# Altium schematic sheet DCDC_Converters.SchDoc: OLC_DCDC_Converters
size A4; ApprovedBy: Emmanuel Plascencia; CheckedBy: Emmanuel Plascencia; DocumentNumber: 2; SheetNumber: 2; SheetTotal: 3; Size: A
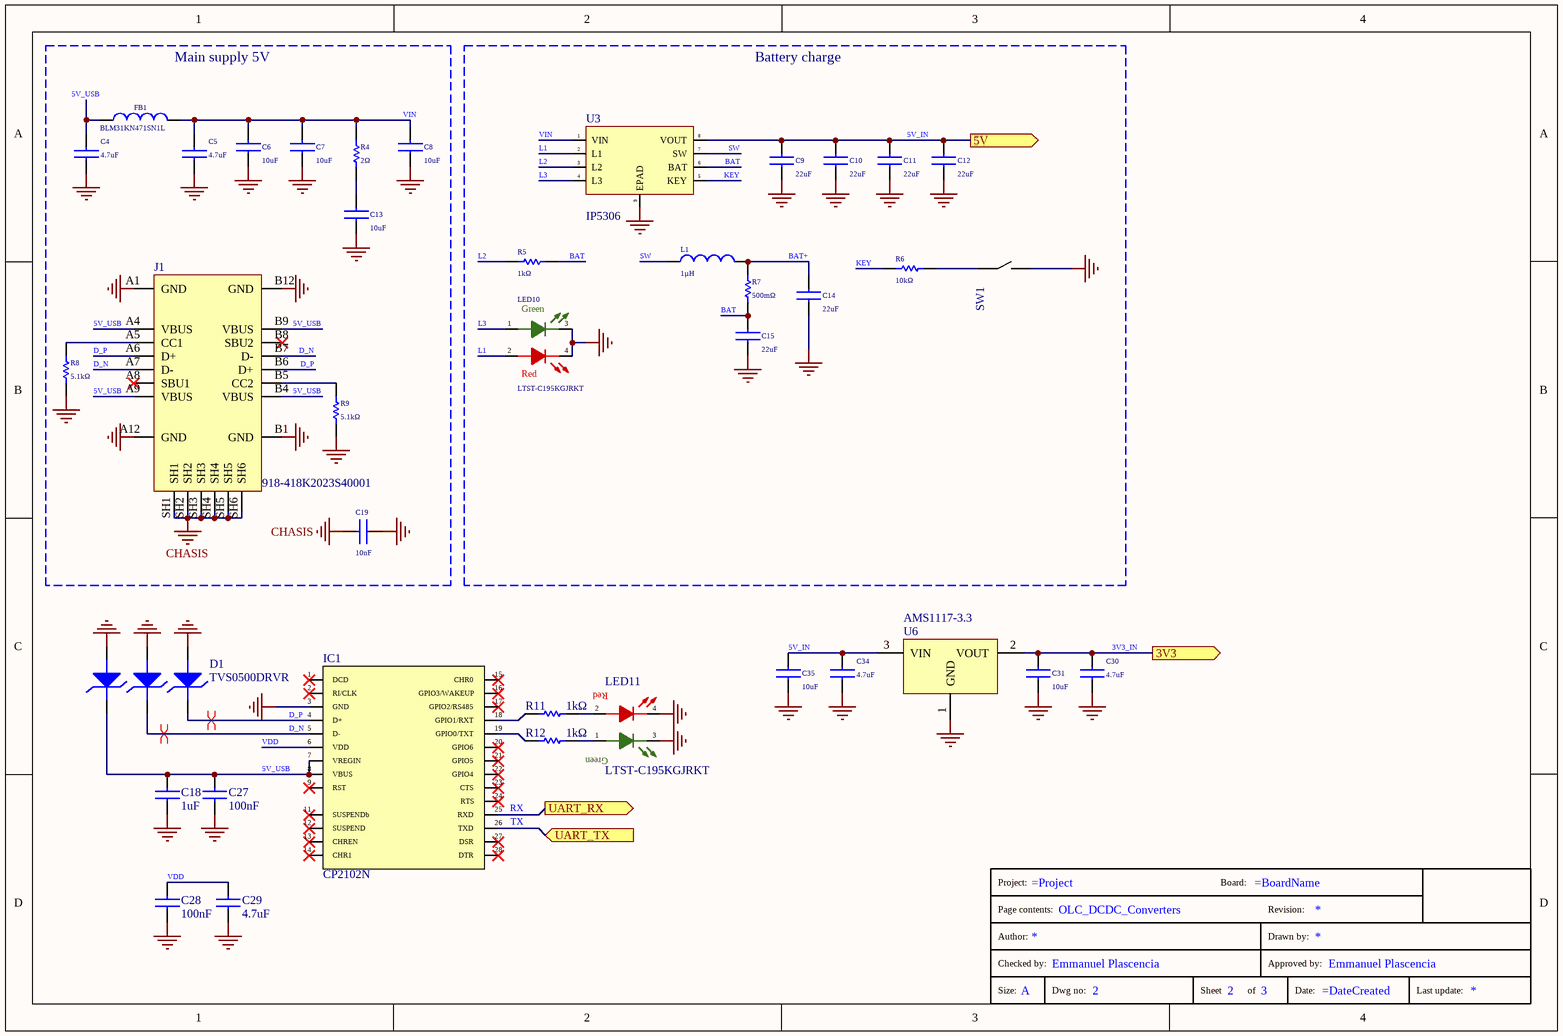
[diagram p0: DCDC_Converters.SchDoc]

## Parts
C4  4.7uF  [CAP0402]
C5  4.7uF  [CAP0402]
C6  10uF  [CAP0402_1.2*0.7]
C7  10uF  [CAP0402_1.2*0.7]
C8  10uF  [CAP0402_1.2*0.7]
C9  22uF  [CAP0805]
C10  22uF  [CAP0805]
C11  22uF  [CAP0805]
C12  22uF  [CAP0805]
C13  10uF  [CAP0402_1.2*0.7]
C14  22uF  [CAP0805]
C15  22uF  [CAP0805]
C18  1uF  [CAP0402]
C19  10nF  [CAP0402]
C27  100nF  [CAP0402]
C28  100nF  [CAP0402]
C29  4.7uF  [CAP0402]
C30  4.7uF  [CAP0402]
C31  10uF  [CAP0402_1.2*0.7]
C34  4.7uF  [CAP0402]
C35  10uF  [CAP0402_1.2*0.7]
D1  TVS0500DRVR  [SON65P200X80_HS-7N]
FB1  BLM31KN471SN1L  [FB1206_3.4*1.8]
IC1  CP2102N  [PQFN50P500X500X80_HS-29N]
J1  918-418K2023S40001  [918-418K2023S40001]
L1  1µH  [IND5030]
LED10  LTST-C195KGJRKT  [LED0606_LTST]
LED11  LTST-C195KGJRKT  [LED0606_LTST]
R4  2Ω  [RES0402]
R5  1kΩ  [RES0201]
R6  10kΩ  [RES0201]
R7  500mΩ  [RES0805]
R8  5.1kΩ  [RES0201]
R9  5.1kΩ  [RES0201]
R11  1kΩ  [RES0402]
R12  1kΩ  [RES0402]
SW1  TS3735PA 300gf 030  [TS3735PA 300gf 030]  (value not drawn)
U3  IP5306  [SOP127P600X165_HS-9N]
U6  AMS1117-3.3  [SOT230P696X180-4N]
U?  Title Block  (value not drawn)  (graphical)

## Blocks framed on the sheet
Main supply 5V: C4-C8 C13 C19 FB1 J1 R4 R8 R9
Battery charge: C9-C12 C14 C15 L1 LED10 R5-R7 SW1 U3

## Ports
3V3 (out), 5V (out), UART_RX (out), UART_TX (in)

## Nets
CHASIS: C19.1 J1.SH1 J1.SH2 J1.SH3 J1.SH4 J1.SH5 J1.SH6
GND: C4.2 C5.2 C6.2 C7.2 C8.2 C9.2 C10.2 C11.2 C12.2 C13.2 C14.2 C15.2 C18.2 C19.2 C27.2 C28.2 C29.2 C30.2 C31.2 C34.2 C35.2 D1.4(A3) D1.5(A2) D1.6(A1) IC1.3(GND) J1.A1(GND) J1.A12(GND) J1.B1(GND) J1.B12(GND) LED10.3 LED10.4 LED11.3 LED11.4 R8.2 R9.2 SW1.2(A2) U3.9(EPAD) U6.1(GND)
3V3_IN: C30.1 C31.1 U6.2(VOUT) ; port 3V3
5V_IN: C9.1 C10.1 C11.1 C12.1 C34.1 C35.1 U3.8(VOUT) U6.3(VIN) ; port 5V
5V_USB: C4.1 C18.1 C27.1 D1.1(K1) FB1.1 IC1.7(VREGIN) IC1.8(VBUS) J1.A4(VBUS) J1.A9(VBUS) J1.B4(VBUS) J1.B9(VBUS)
BAT: C15.1 R5.1 R7.2 U3.6(BAT)
BAT+: C14.1 L1.2 R7.1
D_N: D1.2(K2) IC1.5(D-) J1.A7(D-) J1.B7(D-)
D_P: D1.3(K3) IC1.4(D+) J1.A6(D+) J1.B6(D+)
KEY: R6.1 U3.5(KEY)
L1: LED10.2 U3.2(L1)
L2: R5.2 U3.3(L2)
L3: LED10.1 U3.4(L3)
RX: IC1.25(RXD) ; port UART_RX
SW: L1.1 U3.7(SW)
TX: IC1.26(TXD) ; port UART_TX
VDD: C28.1 C29.1 IC1.6(VDD)
VIN: C5.1 C6.1 C7.1 C8.1 FB1.2 R4.1 U3.1(VIN)
NetC13_1: C13.1 R4.2
NetIC1_18: IC1.18(GPIO1/RXT) R11.1
NetIC1_19: IC1.19(GPIO0/TXT) R12.1
NetJ1_A5: J1.A5(CC1) R8.1
NetJ1_B5: J1.B5(CC2) R9.1
NetLED11_1: LED11.1 R12.2
NetLED11_2: LED11.2 R11.2
NetR6_2: R6.2 SW1.1(A1)

Not connected (* = marked no-connect by the designer): IC1 1(DCD)* 2(RI/CLK)* 9(RST)* 11(SUSPENDb)* 12(SUSPEND)* 13(CHREN)* 14(CHR1)* 15(CHR0)* 16(GPIO3/WAKEUP)* 17(GPIO2/RS485)* 20(GPIO6)* 21(GPIO5)* 22(GPIO4)* 23(CTS)* 24(RTS)* 27(DSR)* 28(DTR)*; J1 A8(SBU1)* B8(SBU2)*

## Layout directives
differential pair; differential pair class Diff_100ohms; net class High_Speed_Nets: D_N, D_P

## Notes on the sheet
- (in symbol LTST-C195KGJRKT) Green; Red
- (in symbol Title Blok OLEDCOMM) Project:; Board:; Page contents:; Revision:; Author:; Drawn by:; Checked by:; Approved by:; Size:; Dwg no:; Sheet; of; Date:; Last update:

## Library data of the parts
C4 C5 C30 C34 = C0402_4.7uF_6V3_X5R: Capacitor ceramic MLCC - SMD 0402 4.7uF, 6V3, X5R, 20%; Ref Fabricant: CL05A475MQ5NRNC; Ref Fournisseur: C307423; Fournisseur: LCSC; Fabricant: Samsung Electro-Mechanics; Unit Price(100): 0.0041; Unit Price(1000): 0.003; Unit Price(5000): 0.0026; Unit Price(1500): 0.0028; Unit Price(25000): 0.0025; Unit Price(50000): 0.0024; Help URL: https://datasheet.lcsc.com/szlcsc/1810231822_Samsung-Electro-Mechanics-CL05A475MQ5NRNC_C307423.pdf; Unit Price: 0.0041; Unit Price(10): 0.0041; Unit Price(50): 0.0041; Unit Price(500): 0.003
C6 C7 C13 = C0402_10uF_6V3_X5R_: Capacitor ceramic MLCC - SMD 0402 10uF, 6V3, X5R, 20%; Fabricant: Samsung Electro-Mechanics; Fournisseur: LCSC; Ref Fournisseur: C15525; Ref Fabricant: CL05A106MQ5NUNC; Unit Price(100): 0.0068; Unit Price(1000): 0.0052; Unit Price(1500): 0.0049; Unit Price(5000): 0.0044; Unit Price(25000): 0.0041; Unit Price(50000): 0.004; Help URL: https://datasheet.lcsc.com/szlcsc/1810191215_Samsung-Electro-Mechanics-CL05A106MQ5NUNC_C15525.pdf; Unit Price: 0.0068; Unit Price(10): 0.0068; Unit Price(50): 0.0068; Unit Price(500): 0.0052
C8 C31 C35 = C0402_10uF_6V3_X5R_: Capacitor ceramic MLCC - SMD 0402 10uF, 6V3, X5R, 20%; Ref Fabricant: CL05A106MQ5NUNC; Ref Fournisseur: C15525; Fournisseur: LCSC; Fabricant: Samsung Electro-Mechanics; Unit Price(100): 0.0068; Unit Price(1000): 0.0052; Unit Price(1500): 0.0049; Unit Price(5000): 0.0044; Unit Price(25000): 0.0041; Unit Price(50000): 0.004; Help URL: https://datasheet.lcsc.com/szlcsc/1810191215_Samsung-Electro-Mechanics-CL05A106MQ5NUNC_C15525.pdf; Unit Price: 0.0068; Unit Price(10): 0.0068; Unit Price(50): 0.0068; Unit Price(500): 0.0052
C9-C12 C14 C15 = C0805_22uF_10V_X7T: Capacitor ceramic MLCC - SMD 0805 22uF, 10V, X7T, 20%; Ref Fabricant: GRM21BD71A226ME44L; Ref Fournisseur: C385042; Fournisseur: LCSC; Fabricant: Murata; Unit Price(100): 0.0840; Unit Price(10): 0.1846; Unit Price(1000): 0.0813; Unit Price(500): 0.0822; Unit Price(30): 0.1627; Help URL: https://datasheet.lcsc.com/lcsc/2001041604_Murata-Electronics-GRM21BD71A226ME44L_C385042.pdf; Unit Price: 0.2147
C18 = C0402_1uF_10V_X7R: Capacitor ceramic MLCC - SMD 0402 1uF, 10V, X7R, 10%; Ref Fabricant: GRM155Z71A105KE01J; Ref Fournisseur: 81-GRM155Z71A105KE1J; Fournisseur: Mouser; Fabricant: Murata; Unit Price(100): 0,034; Unit Price(10): 0,072; Unit Price(1000): 0,02; Unit Price(500): 0,024; Unit Price(5000): 0,017; Unit Price(25000): 0,016; Help URL: https://www.mouser.fr/ProductDetail/Murata-Electronics/GRM155Z71A105KE01J?qs=xZ%2FP%252Ba9zWqaF%2FmyRgV0iOA%3D%3D; Unit Price: 0,102; Unit Price(50): 0,072; Unit Price(1500): 0,02
C19 = C0402_10nF_50V_X7R: Capacitor ceramic MLCC - SMD 0402 10nF, 50V, X7R, 10%; Ref Fabricant: CC0402KRX7R9BB103; Ref Fournisseur: C60133; Fournisseur: LCSC; Fabricant: Yageo; Unit Price(100): 0.001; Unit Price(1000): 0.0008; Unit Price(3000): 0.0007; Unit Price(10000): 0.0006; Unit Price(50000): 0.0005; Help URL: https://datasheet.lcsc.com/lcsc/1810200014_YAGEO-CC0402KRX7R9BB103_C60133.pdf; Unit Price: 0.001; Unit Price(10): 0.001
C27 C28 = C0402_100nF_100V_X5R: Capacitor ceramic MLCC - SMD 0402 100nF, 100V, X5R, 20%; Ref Fabricant: CC0402KRX5R9BB104; Ref Fournisseur: C105882; Fournisseur: LCSC; Fabricant: YAGEO; Unit Price(100): 0.0024; Unit Price(1000): 0.0019; Unit Price(3000): 0.0016; Unit Price(10000): 0.0015; Unit Price(50000): 0.0013; Help URL: https://datasheet.lcsc.com/lcsc/1811131731_YAGEO-CC0402KRX5R9BB104_C105882.pdf; Unit Price: 0.0024; Unit Price(10): 0.0024
C29 = C0402_4.7uF_6V3_X5R: Capacitor ceramic MLCC - SMD 0402 4.7uF, 6V3, X5R, 20%; Ref Fabricant: CL05A475MQ5NRNC; Ref Fournisseur: C307423; Fournisseur: LCSC; Fabricant: Samsung Electro-Mechanics; Unit Price(100): 0.0041; Unit Price(1000): 0.003; Unit Price(1500): 0.0028; Unit Price(5000): 0.0026; Unit Price(25000): 0.0025; Unit Price(50000): 0.0024; Help URL: https://datasheet.lcsc.com/szlcsc/1810231822_Samsung-Electro-Mechanics-CL05A475MQ5NRNC_C307423.pdf; Unit Price: 0.0041; Unit Price(10): 0.0041; Unit Price(50): 0.0041; Unit Price(500): 0.003
D1 = TVS0500DRVR: 27.7VC Clamp 40A@8/20us Ipp TVS DIODE WSON-6-EP(2x2); Fabricant: Texas instruments; Fournisseur: LCSC; Ref Fournisseur: C609571; Unit Price(10): 0.3255; Unit Price(100): 0.2457; Unit Price(1000): 0.2298; Help URL: https://www.ti.com/lit/ds/symlink/tvs0500.pdf?ts=1776012452748; Ref Fabricant: TVS0500DRVR; Unit Price: 0.4117
FB1 = FB1206_470Z_20mR_4A: Ferrite Bead SMD 1206, 470Z, 20mΩ, 4A, 25%; Fabricant: Murata Electronics; Fournisseur: LCSC; Ref Fournisseur: C703117; Unit Price(100): 0.083; Unit Price(10): 0.0962; Unit Price(1000): 0.0786; Unit Price(30): 0.0896; Unit Price(500): 0.08; Help URL: https://www.mouser.fr/datasheet/2/281/c31e-794748.pdf; Ref Fabricant: BLM31KN471SN1L; Unit Price: 0.1323
IC1 = CP2102N: USB to UART USB 2.0 QFN-28-EP(5x5) Interface Controllers RoHS; Fournisseur: LCSC; Ref Fournisseur: C964632; Fabricant: Silicon Labs; Ref Fabricant: CP2102N-A02-GQFN28R; Unit Price(10): 1.3771; Unit Price(100): 1.1014; Help URL: https://www.lcsc.com/datasheet/C964632.pdf?spm=wm.sxq.inf.ggs___wm.fly.bg.1.xh&lcsc_vid=FgJXV1VSRgJaVwUHEgQNVVQEQlFXBl0FFVhdUwYFRgUxVlNRQVFWUVdQQllYUjsOAxUeFF5JWBYZEEoKFBINSQcJGk4dAgUUFAk%3D; Unit Price: 1.58
J1 = 918-418K2023S40001: USB 2.0 F type C, SMD; Fournisseur: LCSC; Ref Fournisseur: C167321; Fabricant: Jing Extension of the Electronic Co.; Unit Price(100): 0.2512; Unit Price(10): 0.2788; Unit Price(1000): 0.242; Unit Price(30): 0.265; Unit Price(500): 0.2451; Help URL: http://www.dzyjzj.com/Uploads/Product/USB%20TYPE%20C%203.1%20%E5%9B%9B%E8%84%9A%E6%8F%92%E6%9D%BF%20%E5%8F%8C%E6%8E%92SMT%20%E6%9C%89%E6%9F%B1%E6%97%A0%E5%87%B8%E5%8C%85/USB%20TYPE%20C%203.1%20%E5%9B%9B%E8%84%9A%E6%8F%92%E6%9D%BF%20%E5%8F%8C%E6%8E%92SMT%20%E6%9C%89%E6%9F%B1%E6%97%A0%E5%87%B8%E5%8C%85%E5%B7%A5%E7%A8%8B%E5%9B%BE.jpg; Ref Fabricant: 918-418K2023S40001; Unit Price: 0.3539
L1 = IND5030_1µH_10.5mR_8.5A: 8.5A 1uH ±20% 8.5A 10.5mΩ SMD,5.2x5.7mm Inductors (SMD) ROHS; Fabricant: KOHERelec; Fournisseur: LCSC; Ref Fabricant: MDA5030-1R0M; Ref Fournisseur: C2847474; Unit Price(100): 0.3677; Unit Price(10): 0.4595; Unit Price(1000): 0.2924; Help URL: https://datasheet.lcsc.com/lcsc/2109101630_KOHERelec-MDA5030-1R0M_C2847474.pdf; Unit Price: 0.5514
LED10 LED11 = LTST-C195KGJRKT: LED standard - CMS Green/Red Clear 571nm/631nm, 0606; Ref Fournisseur: C125104; Fournisseur: LCSC; Fabricant: Lite-On; Unit Price(10): 0.0304; Unit Price(100): 0.0224; Unit Price(1000): 0.0195; Unit Price(300): 0.021; Unit Price(5000): 0.0188; Unit Price(10000): 0.0185; Ref Fabricant: LTST-C195KGJRKT; Help URL: https://datasheet.lcsc.com/lcsc/1811100910_Lite-On-LTST-C195KGJRKT_C125104.pdf; Unit Price: 0.0304
R4 = R0402_2R_50V_Thick: Resistor Thick Film SMD 0402, 2Ω, 50V, 1/16W, 1%; Ref Fabricant: RC0402JR-072RL; Ref Fournisseur: C137886; Fournisseur: LCSC; Fabricant: YAGEO; Unit Price(100): 0.0009; Unit Price(1000): 0.0008; Unit Price(10000): 0.0007; Help URL: https://datasheet.lcsc.com/lcsc/1810231325_YAGEO-RC0402JR-072RL_C137886.pdf; Unit Price: 0.0009; Unit Price(10): 0.0009
R5 = R0201_1k_25V_Thick: Resistor Thick Film SMD 0201, 1kΩ, 25V, 1/20W, 1%; Ref Fabricant: RC0201FR-071KL; Ref Fournisseur: C138165; Fournisseur: LCSC; Fabricant: YAGEO; Unit Price(100): 0.001; Unit Price(1000): 0.0007; Unit Price(10000): 0.0006; Help URL: https://datasheet.lcsc.com/lcsc/1810241131_YAGEO-RC0201FR-071KL_C138165.pdf; Unit Price: 0.001; Unit Price(10): 0.001
R6 = R0201_10k_25V_Thick: Resistor Thick Film SMD 0201,10kΩ, 25V, 1/20W, 1%; Ref Fabricant: RC0201FR-0710KL; Ref Fournisseur: C106225; Fournisseur: LCSC; Fabricant: YAGEO; Unit Price(100): 0.0011; Unit Price(1000): 0.0008; Unit Price(10000): 0.0007; Unit Price(50000): 0.0006; Help URL: https://datasheet.lcsc.com/lcsc/1811101938_YAGEO-RC0201FR-0710KL_C106225.pdf; Unit Price: 0.0011; Unit Price(10): 0.0011; Unit Price(3000): 0.0007
R7 = R0805_500mR_Current_Sense: Resistor Current Sense SMD 0805, 500mΩ,1/8W, 1%; Ref Fabricant: 0805W8F500LT5E; Ref Fournisseur: C28319; Fournisseur: LCSC; Fabricant: UNI-ROYAL; Unit Price(100): 0.0035; Unit Price(1000): 0.0028; Help URL: https://datasheet.lcsc.com/lcsc/2206010030_UNI-ROYAL-Uniroyal-Elec-0805W8F500LT5E_C28319.pdf; Unit Price: 0.0035; Unit Price(10): 0.0035
R8 R9 = R0201_5.1k_25V_Thick: Resistor Thick Film SMD 0201, 5.1kΩ, 25V, 1/20W, 1%; Ref Fabricant: RC0201FR-075K1L; Ref Fournisseur: C274341; Fournisseur: LCSC; Fabricant: Yageo; Unit Price(100): 0.0012; Unit Price(1000): 0.001; Unit Price(3000): 0.0009; Unit Price(50000): 0.0008; Help URL: https://datasheet.lcsc.com/szlcsc/1810241114_YAGEO-RC0201FR-075K1L_C274341.pdf; Unit Price: 0.0012; Unit Price(10): 0.0012
R11 R12 = R0402_1k_50V_Thin: Resistor Thin Film SMD 0402, 1kΩ, 50V, 1/16W, 1%; Ref Fabricant: RT0402FRE071KL; Ref Fournisseur: 603-RT0402FRE071KL; Fournisseur: Mouser; Fabricant: Yageo; Unit Price(100): 0.017; Unit Price(10): 0.049; Unit Price(1000): 0.012; Help URL: https://www.mouser.fr/datasheet/2/447/PYu-RT_1-to-0.01_RoHS_L_9-1222720.pdf; Unit Price: 0.087
SW1 = TS3735PA 300gf 030: Tactile Switch SPST 300gf Surface Mount; Fournisseur: LCSC; Ref Fournisseur: C5363478; Fabricant: SHOU HAN; Unit Price(50): 0.0188; Unit Price(500): 0.0147; Unit Price(1500): 0.0125; Ref Fabricant: TS3735PA 300gf 030; Help URL: https://www.lcsc.com/datasheet/C5363478.pdf?spm=wm.sxq.inf.ggs___wm.fly.bg.6.xh&lcsc_vid=FgJXV1VSRgJaVwUHEgQNVVQEQlFXBl0FFVhdUwYFRgUxVlNRQVFXUV1QRVlXXjsOAxUeFF5JWBYZEEoKFBINSQcJGk4NBhADEA4cHktQQ1NADxALGw%3D%3D; Unit Price: 0.0188
U3 = IP5306: 2.1A charging 2.4A discharging Highly integrated mobile power supply SOC; Fabricant: INJOINIC; Fournisseur: LCSC; Ref Fournisseur: C181692; Unit Price(5): 0.2413; Help URL: https://datasheet.lcsc.com/lcsc/2304140030_INJOINIC-IP5306_C181692.pdf; Ref Fabricant: IP5306; Unit Price: 0.2413
U6 = AMS1117-3.3: 1A Bipolar Linear Regulator 3v3; Fabricant: HEERMICR; Ref Fournisseur: C5199435; Fournisseur: LCSC; Unit Price(200): 0.0514; Unit Price(20): 0.0627; Unit Price(600): 0.0458; Unit Price(2500): 0.0361; Ref Fabricant: AMS1117-3.3; Help URL: https://datasheet.lcsc.com/lcsc/2210171700_HEERMICR-AMS1117-3-3_C5199435.pdf; Unit Price: 0.0627
U? = Title Blok OLEDCOMM